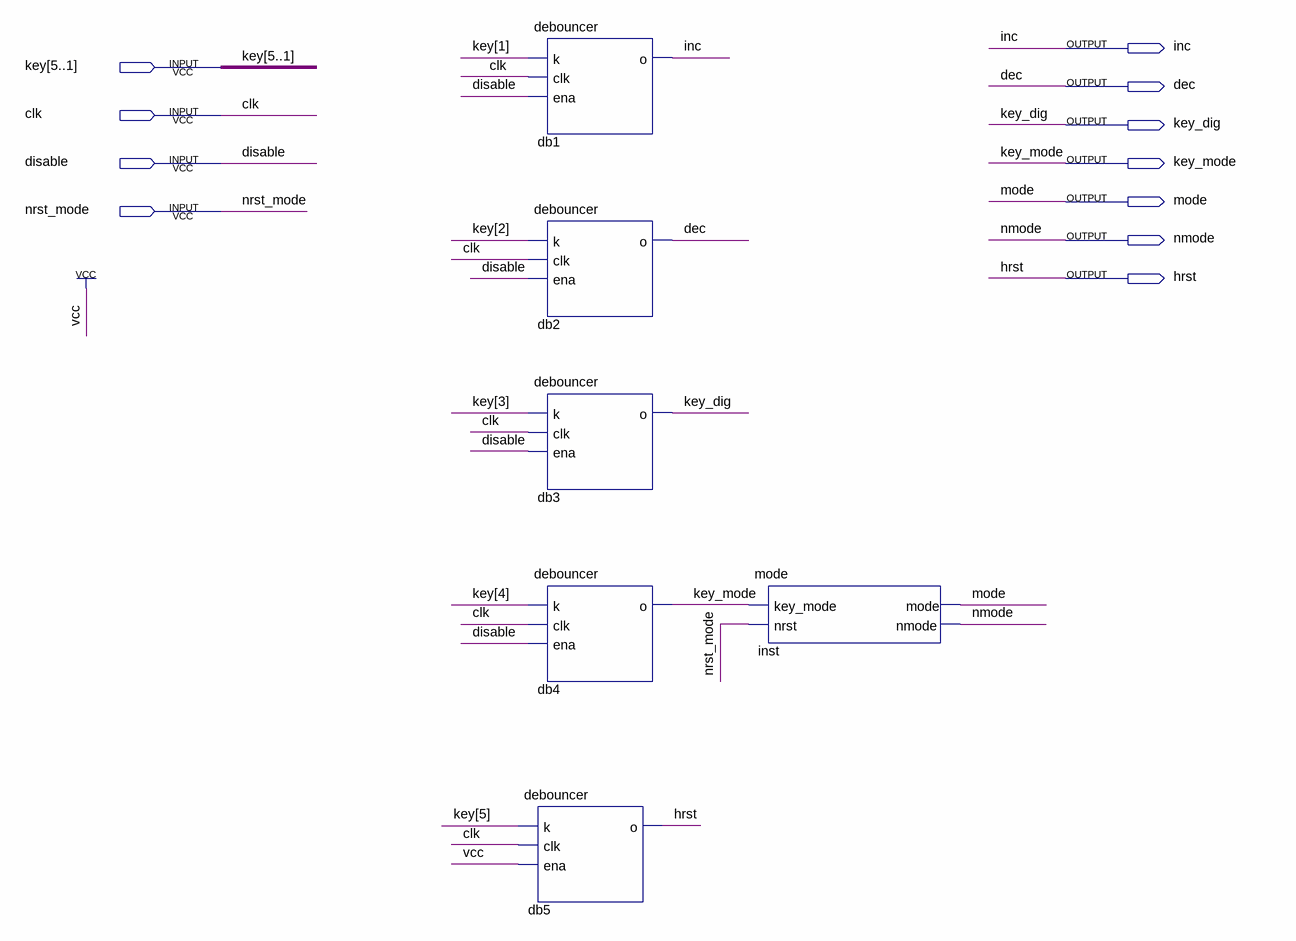
[diagram p0: schematic sheet]
// Quartus schematic block_debouncer.bdf as structural Verilog: 6 symbols, 11 pins
module block_debouncer (
  input  [5:1] key,
  input  clk,
  input  \disable ,
  input  nrst_mode,
  output inc,
  output dec,
  output key_dig,
  output key_mode,
  output mode,
  output nmode,
  output hrst
);

  debouncer db1 (.k(key[1]), .clk(clk), .ena(\disable ), .o(inc));
  debouncer db2 (.k(key[2]), .clk(clk), .ena(\disable ), .o(dec));
  debouncer db3 (.k(key[3]), .clk(clk), .ena(\disable ), .o(key_dig));
  debouncer db4 (.k(key[4]), .clk(clk), .ena(\disable ), .o(key_mode));
  debouncer db5 (.k(key[5]), .clk(clk), .ena(1'b1), .o(hrst));
  mode inst (.key_mode(key_mode), .nrst(nrst_mode), .mode(mode), .nmode(nmode));
endmodule
